# EAGLE design ioniq-v2 (EAGLE 9.6.2)
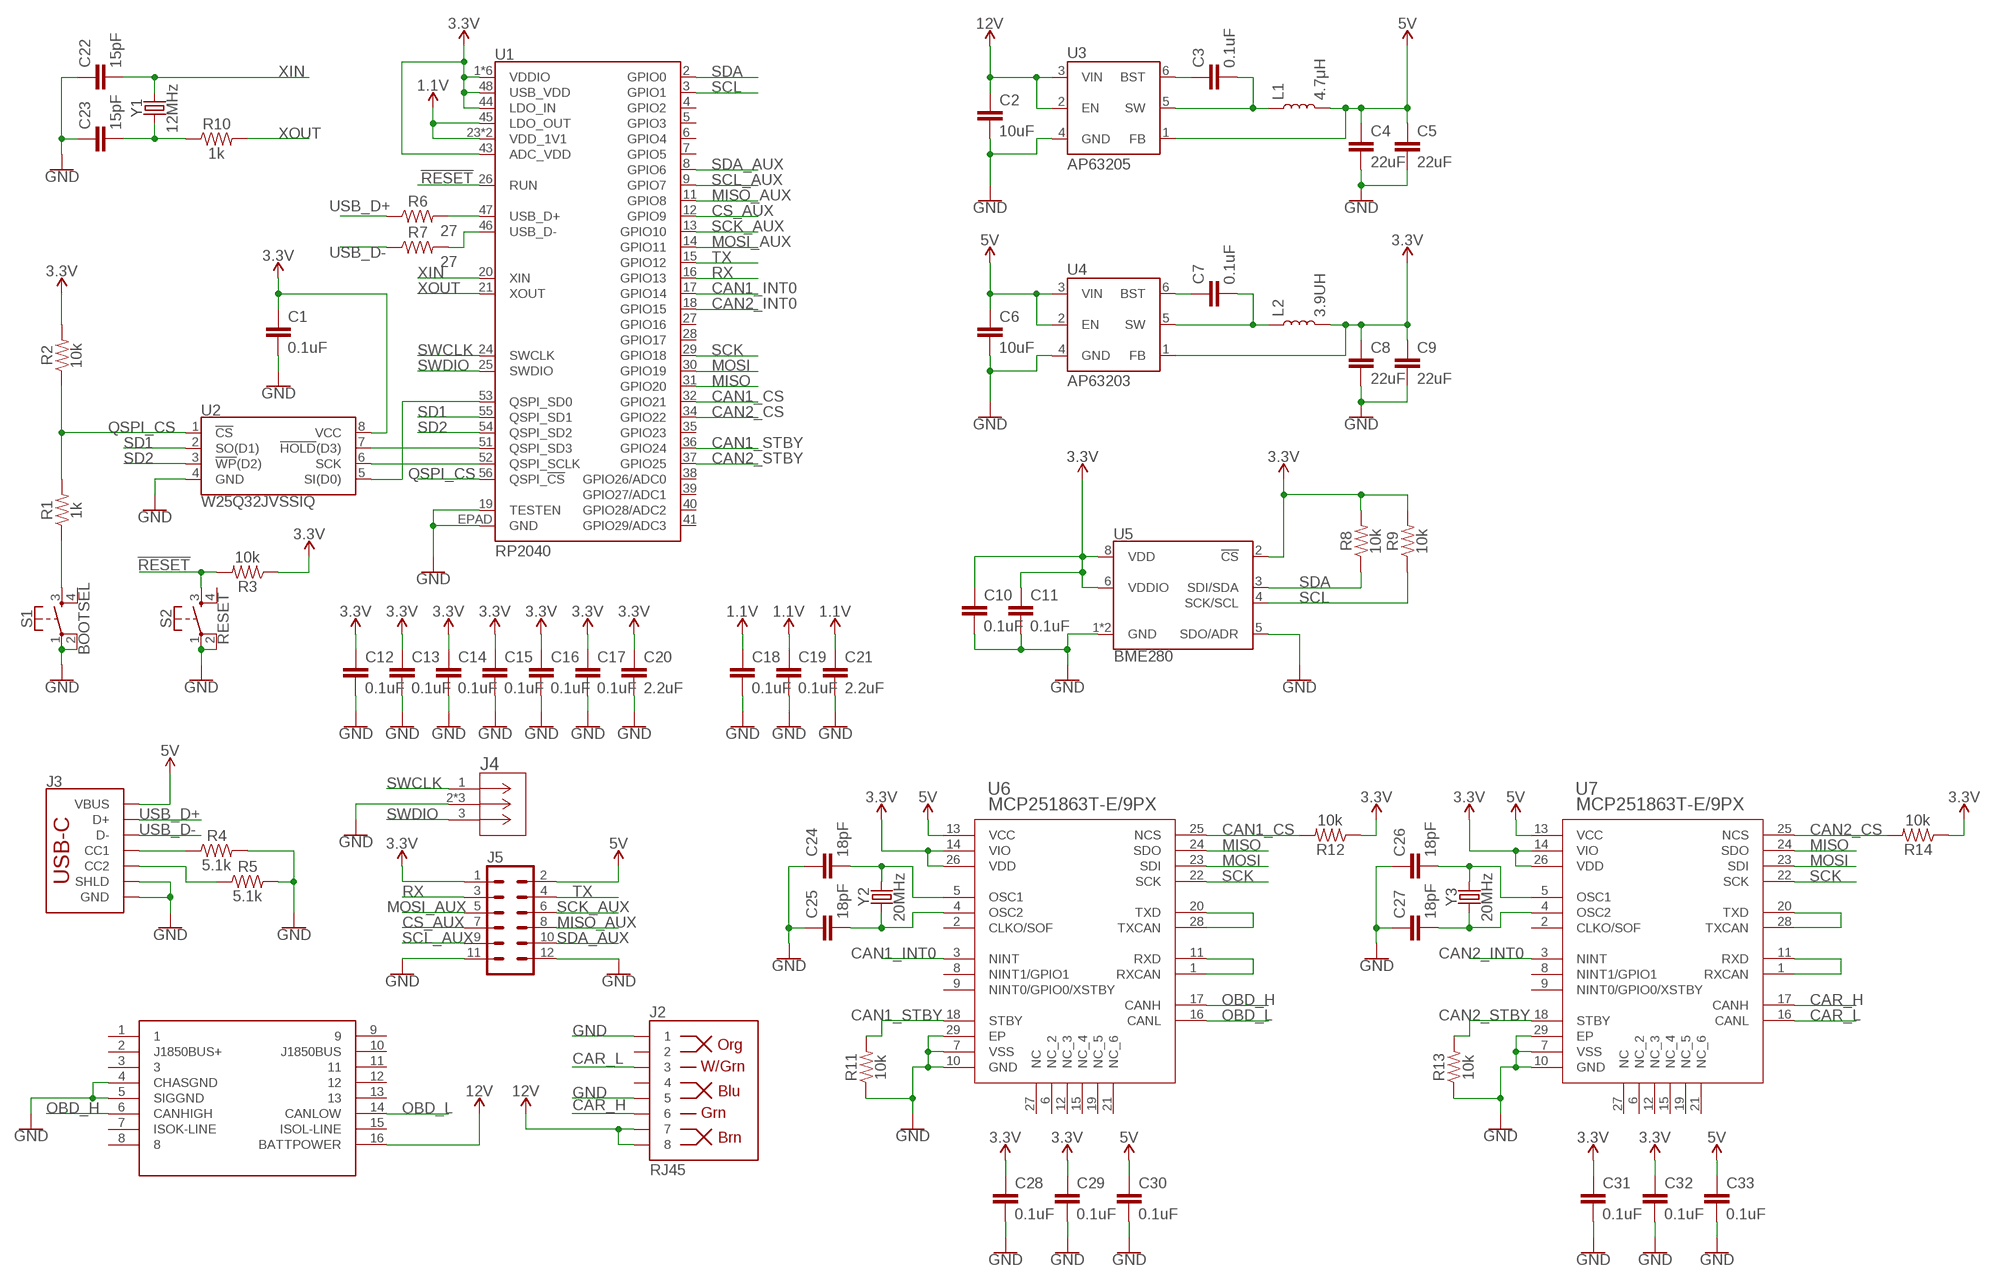
[diagram p0: schematic, sheet 1]

## Parts
C1  0.1uF  0.1UF-0603-25V-10%-X7R-WE  [0603]
C2  10uF  10UF-0805-25V-10%  [0805]
C3  0.1uF  0.1UF-0603-25V-5%  [0603]
C4  22uF  22UF-0603-6.3V-20%  [0603]
C5  22uF  22UF-0603-6.3V-20%  [0603]
C6  10uF  10UF-0805-25V-10%  [0805]
C7  0.1uF  0.1UF-0603-25V-5%  [0603]
C8  22uF  22UF-0603-6.3V-20%  [0603]
C9  22uF  22UF-0603-6.3V-20%  [0603]
C10  0.1uF  0.1UF-0603-25V-10%-X7R-WE  [0603]
C11  0.1uF  0.1UF-0603-25V-10%-X7R-WE  [0603]
C12  0.1uF  0.1UF-0603-25V-10%-X7R-WE  [0603]
C13  0.1uF  0.1UF-0603-25V-10%-X7R-WE  [0603]
C14  0.1uF  0.1UF-0603-25V-10%-X7R-WE  [0603]
C15  0.1uF  0.1UF-0603-25V-10%-X7R-WE  [0603]
C16  0.1uF  0.1UF-0603-25V-10%-X7R-WE  [0603]
C17  0.1uF  0.1UF-0603-25V-10%-X7R-WE  [0603]
C18  0.1uF  0.1UF-0603-25V-10%-X7R-WE  [0603]
C19  0.1uF  0.1UF-0603-25V-10%-X7R-WE  [0603]
C20  2.2uF  2.2UF-0603-10V-20%  [0603]
C21  2.2uF  2.2UF-0603-10V-20%  [0603]
C22  15pF  15PF-0603-50V-5%  [0603]
C23  15pF  15PF-0603-50V-5%  [0603]
C24  18pF  18PF-0603-50V-5%  [0603]
C25  18pF  18PF-0603-50V-5%  [0603]
C26  18pF  18PF-0603-50V-5%  [0603]
C27  18pF  18PF-0603-50V-5%  [0603]
C28  0.1uF  0.1UF-0603-25V-10%-X7R-WE  [0603]
C29  0.1uF  0.1UF-0603-25V-10%-X7R-WE  [0603]
C30  0.1uF  0.1UF-0603-25V-10%-X7R-WE  [0603]
C31  0.1uF  0.1UF-0603-25V-10%-X7R-WE  [0603]
C32  0.1uF  0.1UF-0603-25V-10%-X7R-WE  [0603]
C33  0.1uF  0.1UF-0603-25V-10%-X7R-WE  [0603]
J1  OBDII  [OBDII]
J2  RJ45  RJ45-8  [RJ45-8]
J3  USB_C_2-LAYER_PADS  [USB-C-16P-2LAYER-PADS]
J4  BM03B-SRSS-TB(LF)(SN)  [CONN_BM03B-SRSS-TB(LF)(SN)_JST]
J5  2X6 FEMALE  CONN_06X2PTH_FEMALE  [2X6]
L1  4.7μH  4.7μH_SHIELDED_INDUCTORNPIS_LS  [INDUCTOR_4X4MM]
L2  3.9UH  [INDUCTOR_3.9UH]
R1  1k  1KOHM-0603-1/10W-1%  [0603]
R2  10k  10KOHM-0603-1/10W-1%  [0603]
R3  10k  10KOHM-0603-1/10W-1%  [0603]
R4  5.1k  5.1KOHM5.1KOHM-0603-1/10W-1%  [0603]
R5  5.1k  5.1KOHM5.1KOHM-0603-1/10W-1%  [0603]
R6  27  27OHM-0603-1/10W-1%  [0603]
R7  27  27OHM-0603-1/10W-1%  [0603]
R8  10k  10KOHM-0603-1/10W-1%  [0603]
R9  10k  10KOHM-0603-1/10W-1%  [0603]
R10  1k  1KOHM-0603-1/10W-1%  [0603]
R11  10k  10KOHM-0603-1/10W-1%  [0603]
R12  10k  10KOHM-0603-1/10W-1%  [0603]
R13  10k  10KOHM-0603-1/10W-1%  [0603]
R14  10k  10KOHM-0603-1/10W-1%  [0603]
S1  BOOTSEL  MOMENTARY-SWITCH-SPST-2-SMD-4.6X2.8MM  [TACTILE_SWITCH_SMD_4.6X2.8MM]
S2  RESET  MOMENTARY-SWITCH-SPST-2-SMD-4.6X2.8MM  [TACTILE_SWITCH_SMD_4.6X2.8MM]
U1  RP2040  [QFN-56]
U2  W25Q32JVSSIQ  W25Q32FVSS  [SOIC-8]
U3  AP63205  AP63203  [SOT23-6]
U4  AP63203  [SOT23-6]
U5  BME280  [LGA-8-2.5X2.5]
U6  MCP251863T-E/9PX  [VQFN28_9PX_3P25X3P25EPAD_MCH]
U7  MCP251863T-E/9PX  [VQFN28_9PX_3P25X3P25EPAD_MCH]
Y1  12MHz  CRYSTALSMD-3.2X2.5  [CRYSTAL-SMD-3.2X2.5MM]
Y2  20MHz  CRYSTALSMD-3.2X2.5  [CRYSTAL-SMD-3.2X2.5MM]
Y3  20MHz  CRYSTALSMD-3.2X2.5  [CRYSTAL-SMD-3.2X2.5MM]

## Nets
1.1V: C18.1 C19.1 C21.1 U1.23(VDD_1V1) U1.45(LDO_OUT) U1.50(VDD_1V1)
3.3V: C1.1 C8.1 C9.1 C10.1 C11.1 C12.1 C13.1 C14.1 C15.1 C16.1 C17.1 C20.1 C28.1 C29.1 C31.1 C32.1 J5.1 L2.P$2 R2.2 R3.1 R8.2 R9.2 R12.1 R14.1 U1.1(VDDIO) U1.10(VDDIO) U1.22(VDDIO) U1.33(VDDIO) U1.42(VDDIO) U1.43(ADC_VDD) U1.44(LDO_IN) U1.48(USB_VDD) U1.49(VDDIO) U2.8(VCC) U4.1(FB) U5.2(!CS) U5.6(VDDIO) U5.8(VDD) U6.14(VIO) U6.26(VDD) U7.14(VIO) U7.26(VDD)
5V: C4.1 C5.1 C6.1 C30.1 C33.1 J3.VBUS1(VBUS) J3.VBUS2(VBUS) J5.2 L1.P$2 U3.1(FB) U4.2(EN) U4.3(VIN) U6.13(VCC) U7.13(VCC)
12V: C2.1 J1.16(BATTPOWER) J2.7 J2.8 U3.2(EN) U3.3(VIN)
!RESET: R3.2 S2.3 U1.26(RUN)
CAN1_CS: R12.2 U1.32(GPIO21) U6.25(NCS)
CAN1_INT0: U1.17(GPIO14) U6.3(NINT)
CAN1_STBY: R11.2 U1.36(GPIO24) U6.18(STBY)
CAN2_CS: R14.2 U1.34(GPIO22) U7.25(NCS)
CAN2_INT0: U1.18(GPIO15) U7.3(NINT)
CAN2_STBY: R13.2 U1.37(GPIO25) U7.18(STBY)
CAR_H: J2.6 U7.17(CANH)
CAR_L: J2.3 U7.16(CANL)
CS_AUX: J5.7 U1.12(GPIO9)
GND: C1.2 C2.2 C4.2 C5.2 C6.2 C8.2 C9.2 C10.2 C11.2 C12.2 C13.2 C14.2 C15.2 C16.2 C17.2 C18.2 C19.2 C20.2 C21.2 C22.1 C23.1 C24.1 C25.1 C26.1 C27.1 C28.2 C29.2 C30.2 C31.2 C32.2 C33.2 J1.4(CHASGND) J1.5(SIGGND) J2.1 J2.5 J3.GND J3.GND2(GND) J3.SHLD1(SHLD) J3.SHLD2(SHLD) J3.SHLD3(SHLD) J3.SHLD4(SHLD) J4.2 J4.4 J4.5 J5.11 J5.12 R4.2 R5.2 R11.1 R13.1 S1.1 S1.2 S2.1 S2.2 U1.19(TESTEN) U1.EPAD(GND) U2.4(GND) U3.4(GND) U4.4(GND) U5.1(GND) U5.5(SDO/ADR) U5.7(GND) U6.7(VSS) U6.10(GND) U6.29(EP) U7.7(VSS) U7.10(GND) U7.29(EP)
MISO: U1.31(GPIO20) U6.24(SDO) U7.24(SDO)
MISO_AUX: J5.8 U1.11(GPIO8)
MOSI: U1.30(GPIO19) U6.23(SDI) U7.23(SDI)
MOSI_AUX: J5.5 U1.14(GPIO11)
N$1: U1.52(QSPI_SCLK) U2.6(SCK)
N$2: U1.51(QSPI_SD3) U2.7(!HOLD!(D3))
N$3: U1.53(QSPI_SD0) U2.5(SI(D0))
N$4: J3.A5(CC1) R4.1
N$5: C3.1 U3.6(BST)
N$7: C3.2 L1.P$1 U3.5(SW)
N$8: J3.B5(CC2) R5.1
N$9: C7.1 U4.6(BST)
N$10: C7.2 L2.P$1 U4.5(SW)
N$12: R7.2 U1.46(USB_D-)
N$13: R6.2 U1.47(USB_D+)
N$14: C23.2 R10.1 Y1.1
N$15: R1.1 S1.3
N$16: U6.20(TXD) U6.28(TXCAN)
N$17: U6.1(RXCAN) U6.11(RXD)
N$18: C24.2 U6.5(OSC1) Y2.3
N$19: C25.2 U6.4(OSC2) Y2.1
N$20: U7.1(RXCAN) U7.11(RXD)
N$21: U7.20(TXD) U7.28(TXCAN)
N$22: C26.2 U7.5(OSC1) Y3.3
N$23: C27.2 U7.4(OSC2) Y3.1
OBD_H: J1.6(CANHIGH) U6.17(CANH)
OBD_L: J1.14(CANLOW) U6.16(CANL)
QSPI_CS: R1.2 R2.1 U1.56(QSPI_!CS!) U2.1(!CS!)
RX: J5.3 U1.16(GPIO13)
SCK: U1.29(GPIO18) U6.22(SCK) U7.22(SCK)
SCK_AUX: J5.6 U1.13(GPIO10)
SCL: R9.1 U1.3(GPIO1) U5.4(SCK/SCL)
SCL_AUX: J5.9 U1.9(GPIO7)
SD1: U1.55(QSPI_SD1) U2.2(SO(D1))
SD2: U1.54(QSPI_SD2) U2.3(!WP!(D2))
SDA: R8.1 U1.2(GPIO0) U5.3(SDI/SDA)
SDA_AUX: J5.10 U1.8(GPIO6)
SWCLK: J4.1 U1.24(SWCLK)
SWDIO: J4.3 U1.25(SWDIO)
TX: J5.4 U1.15(GPIO12)
USB_D+: J3.A6(D+) J3.B6(D+) R6.1
USB_D-: J3.A7(D-) J3.B7(D-) R7.1
XIN: C22.2 U1.20(XIN) Y1.3
XOUT: R10.2 U1.21(XOUT)
Unconnected: J1.1 J1.2(J1850BUS+) J1.3 J1.7(ISOK-LINE) J1.8 J1.9 J1.10(J1850BUS) J1.11 J1.12 J1.13 J1.15(ISOL-LINE) J2.2 J2.4 S1.4 S2.4 U1.4(GPIO2) U1.5(GPIO3) U1.6(GPIO4) U1.7(GPIO5) U1.27(GPIO16) U1.28(GPIO17) U1.35(GPIO23) U1.38(GPIO26/ADC0) U1.39(GPIO27/ADC1) U1.40(GPIO28/ADC2) U1.41(GPIO29/ADC3) U6.2(CLKO/SOF) U6.6(NC_2) U6.8(NINT1/GPIO1) U6.9(NINT0/GPIO0/XSTBY) U6.12(NC_3) U6.15(NC_4) U6.19(NC_5) U6.21(NC_6) U6.27(NC) U7.2(CLKO/SOF) U7.6(NC_2) U7.8(NINT1/GPIO1) U7.9(NINT0/GPIO0/XSTBY) U7.12(NC_3) U7.15(NC_4) U7.19(NC_5) U7.21(NC_6) U7.27(NC)

## Library data of the parts
C1 C10-C19 C28-C33 = SparkFun-Capacitors:0.1UF: 0.1µF ceramic capacitors A capacitor is a passive two-terminal electrical component used to store electrical energy temporarily in an electric field.; PROD_ID: CAP-16503
C2 C6 = SparkFun-Capacitors:10UF: 10.0µF ceramic capacitors A capacitor is a passive two-terminal electrical component used to store electrical energy temporarily in an electric field.; PROD_ID: CAP-14259
C3 C7 = SparkFun-Capacitors:0.1UF: 0.1µF ceramic capacitors A capacitor is a passive two-terminal electrical component used to store electrical energy temporarily in an electric field.; PROD_ID: CAP-08604
C4 C5 C8 C9 = SparkFun-Capacitors:22UF: 22µF ceramic capacitors A capacitor is a passive two-terminal electrical component used to store electrical energy temporarily in an electric field.; PROD_ID: CAP-14464
C20 C21 = SparkFun-Capacitors:2.2UF: 2.2µF ceramic capacitors A capacitor is a passive two-terminal electrical component used to store electrical energy temporarily in an electric field.; PROD_ID: CAP-07888
C22 C23 = SparkFun-Capacitors:15PF: 15pF ceramic capacitors A capacitor is a passive two-terminal electrical component used to store electrical energy temporarily in an electric field.; PROD_ID: CAP-07881
C24-C27 = SparkFun-Capacitors:18PF: 18pF ceramic capacitors A capacitor is a passive two-terminal electrical component used to store electrical energy temporarily in an electric field.; PROD_ID: CAP-08267
J1 = SparkFun-Connectors:OBDII: OBD-II Connector OBDII is an on board diagnostics standard that is used on a large variety of cars. Here is the connector we sell at SparkFun: OBD-II connector <https://www.sparkfun.com/products/9911> (DEV-09911) Info and Pinout <http://pinoutsguide.com/CarElectronics/car_obd2_pinout.shtml> (sorry, no datasheet) We do not use this connector on any active designs, however, if you're looking for OBDII tech, please check out these: SparkFun OBD related products <https://www.sparkfun.com/search/results?term=obd>; SF_ID: DEV-09911
J2 = SparkFun-Connectors:RJ45-8: RJ45 Jack - 8 pin Simple RJ45, 8-pin connection. Commonly used for Cat5, Cat5e, and Cat6 Ethernet cables. Here is the connector we sell at SparkFun: RJ45 8-Pin Connector <https://www.sparkfun.com/products/643> (PRT-00643) Datasheet <https://cdn.sparkfun.com/datasheets/Prototyping/04908.pdf> It is used on this SparkFun product: SparkFun RJ45 Breakout <https://www.sparkfun.com/products/716> (BOB-00716) Note, you may also be interested in the "MAGJACK" version of this. It is basically a RJ45 connector, but also has some status LEDs built into the connector housing. You can check that out in this library at the device named "MAGJACK.dev" and see these products online: RJ45 Ethernet MagJack-Compatible <https://www.sparkfun.com/products/8534> (PRT-08534) SparkFun RJ45 MagJack Breakout <https://www.sparkfun.com/products/13021> (BOB-13021); PROD_ID: CONN-08506; SF_ID: PRT-00643
J3 = SparkFun-Connectors:USB_C: USB Type C 16Pin Connector Super Speed pins not available on the 16-pin purely SMD connector so this part is best for USB 2.0 implementations. D1 and D2 are tied together enabling D+/- no matter which way the cable is plugged into the connector. The two channel configuration pins (CC1/2) are exposed. These are normally connected to ground via 5.1k resistors but can be reconfigured for high current/high power applications. **4-LAYER BOARD WARNING!!** If designing 4-layer board, make sure to select the variant _4-LAYER-ISOLATED. The linked footprint (USB-C-16-4LAYER-ISOLATED) includes some very necessary cutout polygons in the inner layers (2 and 15). This prevents the PTH mounting shield legs on the USB connector from electrically connecting any other polygons on the inner layers (usually VCC and GND).; PROD_ID: CONN-14122
J4 = SparkFun-Connectors:BM03B-SRSS-TB(LF)(SN); COPYRIGHT: Copyright (C) 2024 Ultra Librarian. All rights reserved.; MANUFACTURER_PART_NUMBER: BM03B-SRSS-TB(LF)(SN); MFR_NAME: JST
J5 = SparkFun-Connectors:CONN_06X2: Multi connection point. Often used as Generic Header-pin footprint for 0.1 inch spaced/style header connections On any of the 0.1 inch spaced packages, you can populate with these: Break Away Headers - Straight <https://www.sparkfun.com/products/116> (PRT-00116) Break Away Male Headers - Right Angle <https://www.sparkfun.com/products/553> (PRT-00553) Female Headers <https://www.sparkfun.com/products/115> (PRT-00115) Break Away Headers - Machine Pin <https://www.sparkfun.com/products/117> (PRT-00117) Break Away Female Headers - Swiss Machine Pin <https://www.sparkfun.com/products/743> (PRT-00743); PROD_ID: CONN-12423
L1 = SparkFun-Coils:4.7μH_SHIELDED_INDUCTOR: 4.7uH Inductor 4.7uH 1.4A 50mOhm 1008(2520) Package Shielded; PROD_ID: NDUC-15245
L2 = SparkFun-Coils:3.9UH: Würth's Electronik 3.9uH Inductor Characteristics 3.9uH 2.4A Current Rating 2.8A Saturation Inductance Frequency: 100kHzd AEC-Q200 Certified 5mm x 5mm Package 30% tolerance; PROD_ID: NDUC-18014
R1 R10 = SparkFun-Resistors:1KOHM: 1kΩ resistor A resistor is a passive two-terminal electrical component that implements electrical resistance as a circuit element. Resistors act to reduce current flow, and, at the same time, act to lower voltage levels within circuits. - Wikipedia; PROD_ID: RES-07856
R2 R3 R8 R9 R11-R14 = SparkFun-Resistors:10KOHM: 10kΩ resistor A resistor is a passive two-terminal electrical component that implements electrical resistance as a circuit element. Resistors act to reduce current flow, and, at the same time, act to lower voltage levels within circuits. - Wikipedia; PROD_ID: RES-00824
R4 R5 = SparkFun-Resistors:5.1KOHM; PROD_ID: RES-12083
R6 R7 = SparkFun-Resistors:27OHM: 27Ω resistor A resistor is a passive two-terminal electrical component that implements electrical resistance as a circuit element. Resistors act to reduce current flow, and, at the same time, act to lower voltage levels within circuits. - Wikipedia; PROD_ID: RES-09334
S1 S2 = SparkFun-Switches:MOMENTARY-SWITCH-SPST-2: Momentary Switch (Pushbutton) - SPST - Two Circuits Normally-open (NO) SPST momentary switches (buttons, pushbuttons). Schematic symbol includes two switch circuits. Variants SMD-4.6MMX2.8MM - 4.60mm x 2.80mm Tactile Momentary Button Switch - Used on SparkFun Pro Micro - RP2040 <https://www.sparkfun.com/products/17717> SMD-5.2MM - Mini Pushbutton Switch - SMD <https://www.sparkfun.com/products/8720> - Used on Arduino Pro Mini <https://www.sparkfun.com/products/11114>; PROD_ID: SWCH-15606
U1 = SparkFun-IC-Microcontroller:RP2040: Raspberry Pi RP2040 MCU 56-pin 32-bit Microcontroller with 264kB of SRAM and external flash support up to 16MB Getting Started with the RP2040 <https://pico.raspberrypi.org/getting-started/> Dual-core ARM Cortex M0+ processor, flexible clock running up to 133 MHz 264kB of SRAM, and QSPI control of common flash memory USB 1.1 Host and Device support Low-power sleep and dormant modes Drag & drop programming using mass storage over USB 26 multi-function GPIO pins 2×SPI, 2×I2C, 2×UART, 3×12-bit ADC, 16×controllable PWM channels Accurate clock and timer on-chip Temperature sensor Accelerated floating point libraries on-chip 8×Programmable IO (PIO) state machines for custom peripheral support; PROD_ID: IC-15502
U2 = SparkFun-IC-Memory:W25Q32FV: W25Q32FV 32Mb (4MB) Serial Flash Memory The W25Q32FV support the standard Serial Peripheral Interface (SPI), Dual/Quad I/O SPI as well as 2-clocks instruction cycle Quad Peripheral Interface (QPI). 104MHz, SPI, 8-SOIC-EIAJ Datasheet <http://www.winbond.com/resource-files/w25q32fv%20revh%20091613.pdf> SparkFun Products SparkFun Blynk Board - ESP8266 <https://www.sparkfun.com/products/13794> (WRL-13794); PROD_ID: IC-13229; VALUE: W25Q32FV
U3 = SparkFun-IC-Power:AP63203: Diodes Inc. AP63203 3.8V-32V input 3.3V Buck The AP63200/AP63201/AP63203/AP63205 is a 2A, synchronous buck converter with a wide input voltage range of 3.8V to 32V and fully integrates a 125mΩ high-side power MOSFET and a 68mΩ lowside power MOSFET to provide high-efficiency step-down DC/DC conversion; PROD_ID: VREG-15244; VALUE: AP63203
U4 = SparkFun-IC-Power:AP63203: Diodes Inc. AP63203 3.8V-32V input 3.3V Buck The AP63200/AP63201/AP63203/AP63205 is a 2A, synchronous buck converter with a wide input voltage range of 3.8V to 32V and fully integrates a 125mΩ high-side power MOSFET and a 68mΩ lowside power MOSFET to provide high-efficiency step-down DC/DC conversion; PROD_ID: VREG-15244
U5 = SparkFun-Sensors:BME280: Bosch BME280 – Combined Humidity and Pressure Sensor The BME280 is as combined digital humidity, pressure and temperature sensor based on proven sensing principles. The sensor module is housed in an extremely compact metal-lid LGA package with a footprint of only 2.5×2.5mm² with a height of 0.93mm. Its small dimensions and its low power consumption allow the implementation in battery driven devices such as handsets, GPS modules or watches. Datasheet <https://cdn.sparkfun.com/assets/learn_tutorials/4/1/9/BST-BME280_DS001-10.pdf> SparkFun Products SparkFun Atmospheric Sensor Breakout - BME280 <https://www.sparkfun.com/products/13676> (SEN-13676); PROD_ID: IC-13090
U6 U7 = SparkFun-IC-Comms:MCP251863T-E/9PX; COPYRIGHT: Copyright (C) 2024 Ultra Librarian. All rights reserved.; MANUFACTURER_PART_NUMBER: MCP251863T-E/9PX; MFR_NAME: Microchip; TYPE: Interface
Y1-Y3 = SparkFun-Clocks:CRYSTAL: Crystals (Generic) These are passive quartz crystals, which can be used as a clock source for a microcontroller. Crystal's are two-terminal devices. They require external "load" capacitors to generate an oscillating signal.

## Board
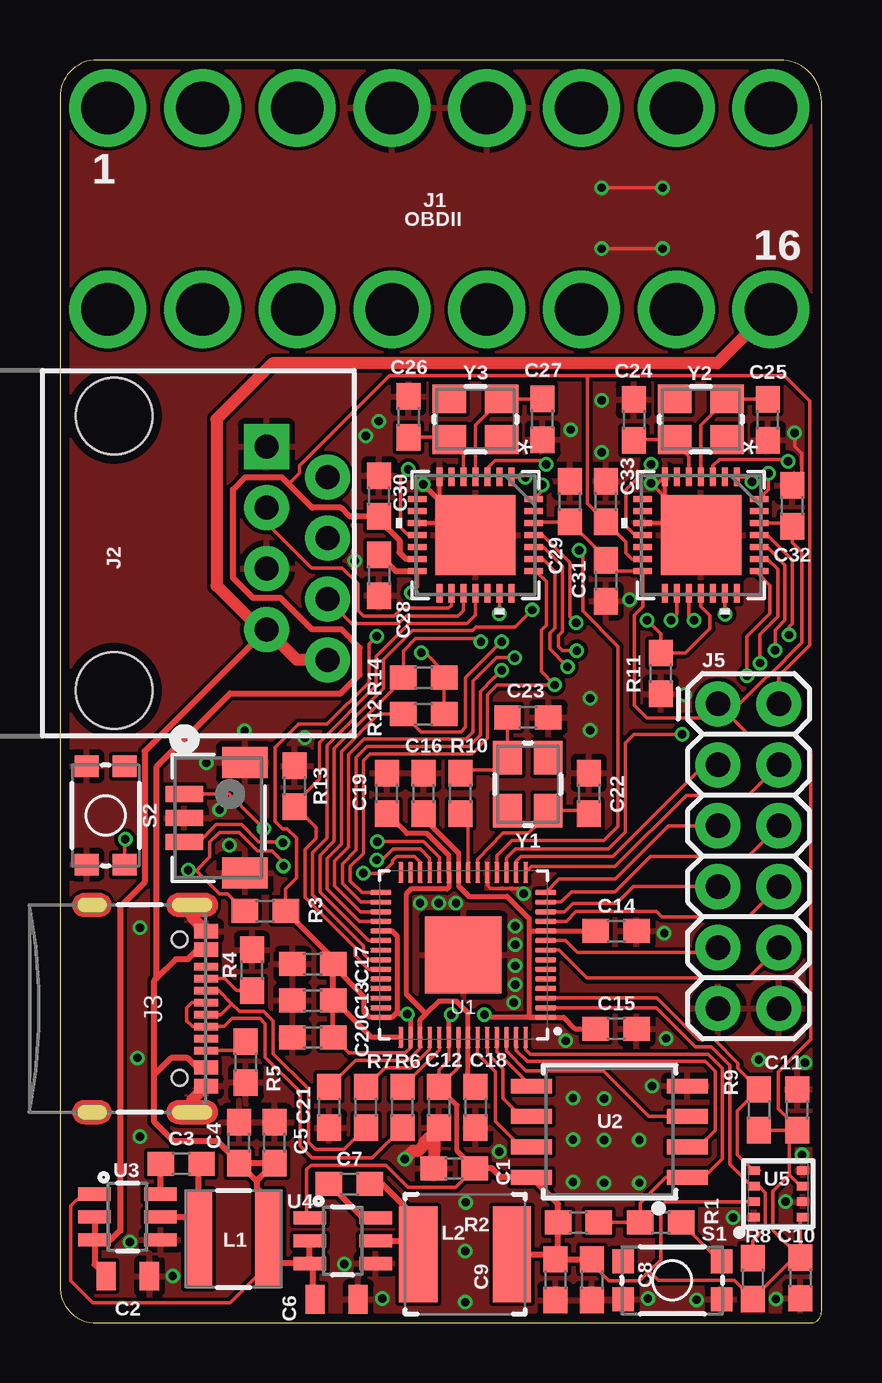
[diagram p1: board, top side]
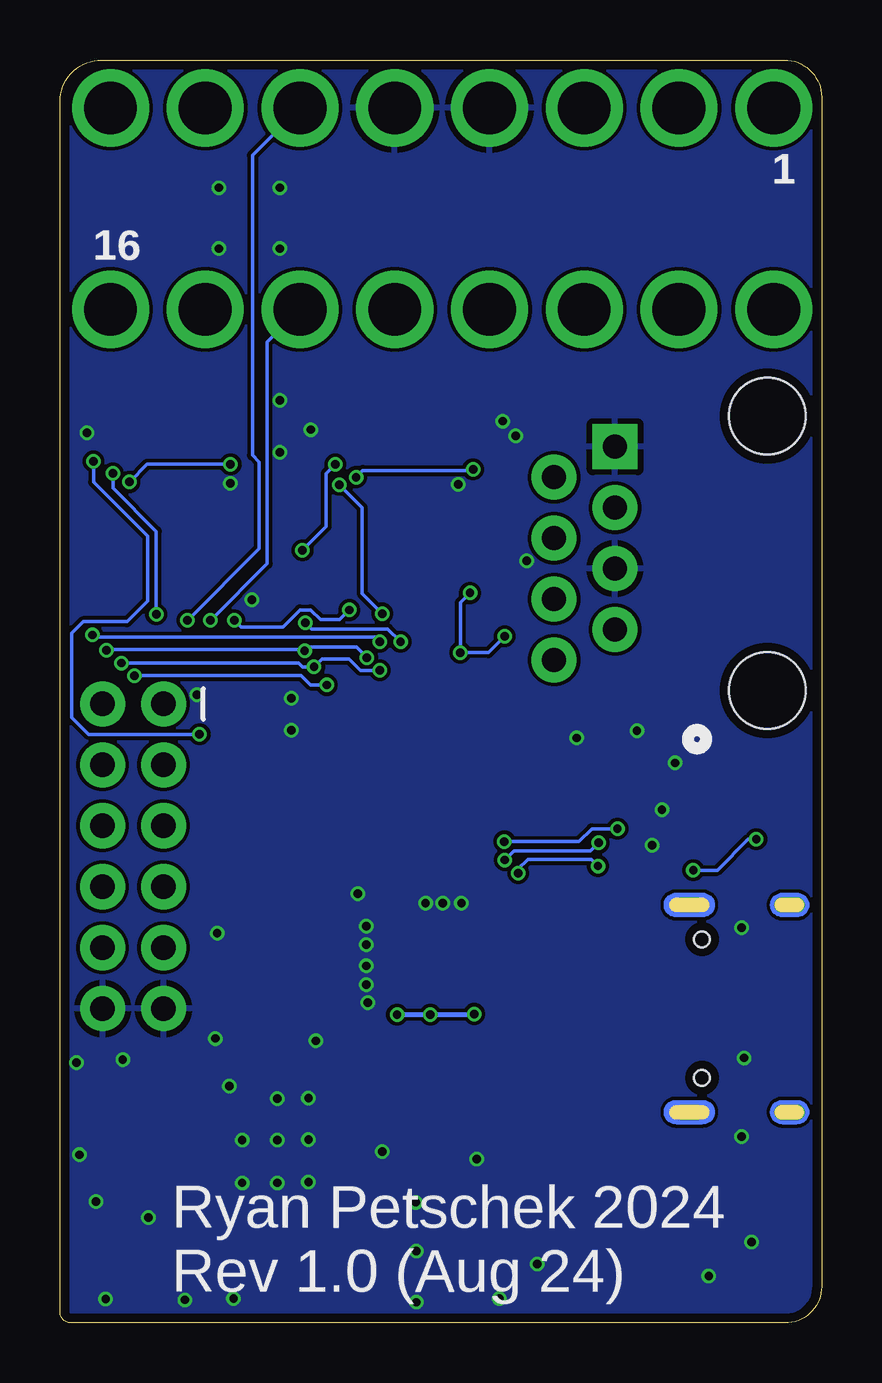
[diagram p2: board, bottom side, seen from below]

Size 31.75 x 52.64 mm. Coordinates in mm from the lower left corner, seen from the top.
Outline: 0,51.1 0,1.52 arc90 1.52,0 31.28,0 arc90 31.75,0.47 31.75,50.9 arc90 30.01,52.64 1.54,52.64 arc90 0,51.1
Copper layers (1*16): Top 0.035559375mm / dielectric 1.6mm / Bottom 0.035559375mm
Design rules "oshpark-2layer": minimum track width 6mil, minimum drill 10mil, track to track 6mil, track to pad 6mil, pad to pad 6mil, via to via 6mil, smd to smd 6mil, copper to edge 15mil, drill to drill 6mil, minimum pad ring 5mil, minimum via ring 5mil, stop-mask expansion 2.5mil, vias tented up to drill 0mil, thermal gap 10mil

### Footprints (pad centres in the part's own frame; a part is rotated, then mirrored left to right if it is on the bottom)
0603 = smd 1.1 x 1: 1 -0.85,0; 2 0.85,0
0805 = smd 0.8 x 1.2: 1 -0.9,0; 2 0.9,0
OBDII = drill 2.2: 1 13.68,-3.81; 2 9.73,-3.81; 3 5.78,-3.81; 4 1.83,-3.81; 5 -2.12,-3.81; 6 -6.07,-3.81; 7 -10.02,-3.81; 8 -13.97,-3.81; 9 13.68,4.59; 10 9.73,4.59; 11 5.78,4.59; 12 1.83,4.59; 13 -2.12,4.59; 14 -6.07,4.59; 15 -10.02,4.59; 16 -13.97,4.59
RJ45-8 = drill 1 pad 1.88 square: 1 -4.445,6.35 | drill 1 pad 1.88: 2 -3.175,8.89; 3 -1.905,6.35; 4 -0.635,8.89; 5 0.635,6.35; 6 1.905,8.89; 7 3.175,6.35; 8 4.445,8.89 | hole 3.2: -5.715,0; 5.715,0
USB-C-16P-2LAYER-PADS = smd 0.3 x 1: A5 -1.25,-0.34; A6 -0.25,-0.34; A7 0.25,-0.34; A8 1.25,-0.34; B5 1.75,-0.34; B6 0.75,-0.34; B7 -0.75,-0.34; B8 -1.75,-0.34 | smd 0.6 x 1: GND -3.225,-0.34; GND2 3.225,-0.34; VBUS1 -2.45,-0.34; VBUS2 2.45,-0.34 | drill 0.4 pad 0.6 long: SHLD1 -4.318,-0.915; SHLD2 4.318,-0.915; SHLD3 -4.318,-5.095; SHLD4 4.318,-5.095 | hole 0.65: -2.89,-1.445; 2.89,-1.445
CONN_BM03B-SRSS-TB(LF)(SN)_JST = smd 0.66 x 1.549: 1 1,1.428; 2 0,1.428; 3 -1,1.428 | smd 1.295 x 1.905: 4 -2.3,-1.097; 5 2.3,-1.097
2X6 = drill 1.016 pad 1.88: 1 0,0; 2 0,2.54; 3 2.54,0; 4 2.54,2.54; 5 5.08,0; 6 5.08,2.54; 7 7.62,0; 8 7.62,2.54; 9 10.16,0; 10 10.16,2.54; 11 12.7,0; 12 12.7,2.54
INDUCTOR_4X4MM = smd 4.089 x 1.143: P$1 0,1.473; P$2 0,-1.473
INDUCTOR_3.9UH = smd 4 x 1.6: P$1 0,-2; P$2 0,1.9
TACTILE_SWITCH_SMD_4.6X2.8MM = smd 0.9 x 1: 1 -2.05,-0.8; 2 2.05,-0.8; 3 2.05,0.8; 4 -2.05,0.8
QFN-56 = smd 0.875 x 0.2: 1 -3.437,2.6; 2 -3.437,2.2; 3 -3.437,1.8; 4 -3.437,1.4; 5 -3.437,1; 6 -3.437,0.6; 7 -3.437,0.2; 8 -3.437,-0.2; 9 -3.437,-0.6; 10 -3.437,-1; 11 -3.437,-1.4; 12 -3.437,-1.8; 13 -3.437,-2.2; 14 -3.437,-2.6; 29 3.437,-2.6; 30 3.437,-2.2; 31 3.437,-1.8; 32 3.437,-1.4; 33 3.437,-1; 34 3.437,-0.6; 35 3.437,-0.2; 36 3.437,0.2; 37 3.437,0.6; 38 3.437,1; 39 3.437,1.4; 40 3.437,1.8; 41 3.437,2.2; 42 3.437,2.6 | smd 0.2 x 0.875: 15 -2.6,-3.437; 16 -2.2,-3.437; 17 -1.8,-3.437; 18 -1.4,-3.437; 19 -1,-3.437; 20 -0.6,-3.437; 21 -0.2,-3.437; 22 0.2,-3.437; 23 0.6,-3.437; 24 1,-3.437; 25 1.4,-3.437; 26 1.8,-3.437; 27 2.2,-3.437; 28 2.6,-3.437; 43 2.6,3.437; 44 2.2,3.437; 45 1.8,3.437; 46 1.4,3.437; 47 1,3.437; 48 0.6,3.437; 49 0.2,3.437; 50 -0.2,3.437; 51 -0.6,3.437; 52 -1,3.437; 53 -1.4,3.437; 54 -1.8,3.437; 55 -2.2,3.437; 56 -2.6,3.437 | smd 3.2 x 3.2: EPAD 0,0
SOIC-8 = smd 0.61 x 1.702: 1 -1.905,-3.251; 2 -0.635,-3.251; 3 0.635,-3.251; 4 1.905,-3.251; 5 1.905,3.251; 6 0.635,3.251; 7 -0.635,3.251; 8 -1.905,3.251
SOT23-6 = smd 0.55 x 1.35: 1 -0.95,-1.375; 2 0,-1.375; 3 0.95,-1.375; 4 0.95,1.375; 5 0,1.375; 6 -0.95,1.375
LGA-8-2.5X2.5 = smd 0.35 x 0.5: 1 -0.975,1.025; 2 -0.325,1.025; 3 0.325,1.025; 4 0.975,1.025; 5 0.975,-1.025; 6 0.325,-1.025; 7 -0.325,-1.025; 8 -0.975,-1.025
VQFN28_9PX_3P25X3P25EPAD_MCH = smd 0.762 x 0.254: 1 -2.426,1.5; 2 -2.426,1; 3 -2.426,0.5; 4 -2.426,0; 5 -2.426,-0.5; 6 -2.426,-1; 7 -2.426,-1.5; 15 2.426,-1.5; 16 2.426,-1; 17 2.426,-0.5; 18 2.426,0; 19 2.426,0.5; 20 2.426,1; 21 2.426,1.5 | smd 0.254 x 0.762: 8 -1.5,-2.426; 9 -1,-2.426; 10 -0.5,-2.426; 11 0,-2.426; 12 0.5,-2.426; 13 1,-2.426; 14 1.5,-2.426; 22 1.5,2.426; 23 1,2.426; 24 0.5,2.426; 25 0,2.426; 26 -0.5,2.426; 27 -1,2.426; 28 -1.5,2.426 | smd 3.353 x 3.353: 29 0,0
CRYSTAL-SMD-3.2X2.5MM = smd 1.4 x 1.2: 1 -1.1,-0.85; 2 1.1,-0.85; 3 1.1,0.85; 4 -1.1,0.85

### Placement (x,y rotation side)
C1  16.43,6.45 180 top
C2  2.83,1.96 0 top
C3  5.05,6.63 0 top
C4  7.47,7.52 90 top
C5  8.94,7.52 90 top
C6  11.53,0.99 0 top
C7  12.06,5.79 0 top
C8  22.17,1.8 270 top
C9  20.65,1.8 270 top
C10  30.86,1.88 270 top
C11  30.73,8.89 90 top
C12  15.8,8.99 270 top
C13  10.54,13.44 180 top
C14  23.19,16.33 0 top
C15  23.19,12.27 0 top
C16  15.16,22.07 90 top
C17  10.54,14.96 180 top
C18  17.32,8.99 270 top
C19  13.64,22.07 90 top
C20  10.54,11.91 180 top
C21  11.23,8.99 270 top
C22  22.05,22.07 270 top
C23  19.51,25.25 180 top
C24  23.93,37.64 270 top
C25  29.51,37.64 90 top
C26  14.53,37.77 270 top
C27  20.12,37.67 90 top
C28  13.31,31.17 270 top
C29  21.26,34.24 90 top
C30  13.31,34.47 90 top
C31  22.76,30.94 270 top
C32  30.53,34.06 90 top
C33  22.76,34.24 90 top
J1  15.67,46.84 180 top
J2  2.26,32.08 270 top
J3  6.43,13.11 270 top
J4  6.61,21.06 90 top
J5  27.43,25.81 270 top
L1  7.24,3.51 90 top
L2  16.94,2.87 270 top
R1  25.04,4.19 180 top
R2  21.62,4.19 180 top
R3  8.56,17.17 180 top
R4  8,14.71 90 top
R5  7.75,10.87 270 top
R6  14.27,8.99 90 top
R7  12.75,8.99 90 top
R8  28.88,1.85 270 top
R9  29.13,8.89 270 top
R10  16.69,22.07 270 top
R11  25.04,27.08 90 top
R12  15.16,25.37 180 top
R13  9.78,22.38 270 top
R14  15.16,26.9 180 top
S1  25.53,1.78 0 top
S2  1.91,21.16 270 top
U1  16.81,15.34 180 top
U2  22.91,7.98 90 top
U3  2.82,4.42 270 top
U4  11.79,3.43 270 top
U5  29.95,5.38 90 top
U6  26.72,32.84 270 top
U7  17.32,32.84 270 top
Y1  19.51,22.45 270 top
Y2  26.72,37.67 180 top
Y3  17.32,37.67 180 top

### Tracks (layer width: path | path; a pad name or v marks a point on that pad's centre or on a via)
1.1V
  Top 0.152: C18.1 17.01,10.15 | U1.45 15.01,11.44 14.52,10.95 12.33,10.95 C21.1
  Top 0.203: 15.27,12.88 15.8,13.41 16.54,13.41 17.01,12.93 U1.50 17.01,10.15 | U1.45 15.01,12.63 15.27,12.88 | 15.27,12.88 14.43,13.72 14.43,17.88 14.63,18.09 16.13,18.09 16.21,18.17 U1.23 16.21,19.49 15.31,20.4 14.47,20.4 C19.1
3.3V  (via drill 0.35)
  Top 0.152: U1.49 16.61,10.66 C12.1 15.81,9.85 15.81,10.56 16.21,10.96 U1.48 | 11.39,14.9 C17.1 | 14.61,11.48 14.39,11.25 12.05,11.25 C20.1 | C1.1 16.5,5.66 14.5,5.66 13.59,6.58 10.46,6.58 10.28,6.4 10.28,4.51 U4.1 | C8.1 22.17,2.46 22.89,1.75 24.15,1.75 24.56,2.16 | 30.94,4.41 U5.8 30.86,4.3 C10.1 | 30.4,6.18 30.87,5.71 U5.6 | C11.1 30.73,7.94 30.4,7.6 30.4,6.18 | 24.56,2.16 25.04,2.64 25.04,4.85 25.25,5.05 U5.2 | 24.56,2.16 24.94,1.78 28.11,1.78 R8.2 30.61,2.73 C10.1 | U6.26 30.4,33.34 C32.1 30.53,32.54 30.93,32.13 30.93,28.36 29.55,26.98 29.49,26.98 28.32,25.81 J5.1 | U7.26 19.8,33.39 C29.1 22.76,31.89 C31.1 23.2,31.34 U6.14 24.3,29.86 23.95,29.52 23.95,25.73 24.46,25.22 26.85,25.22 J5.1 | R12.1 R14.1 16.01,27.14 15.21,27.94 v15.06,27.94 | v14.66,30.43 v14.66,30.44 14.9,30.68 U7.14 | v13.21,28.63 12.88,28.3 12.88,26.7 11.14,24.97 9.96,24.97 8.97,23.98 8.97,20.9 9.27,20.6 9.47,20.6 9.86,20.21 9.86,18.54 9.41,18.1 R3.1 | J5.1 28.7,24.54 30.61,24.54 31.29,23.85 31.29,11.83 29.94,10.47 29.94,8.93 30.73,8.14 C11.1 | R9.2 C11.1 | 30.4,6.18 29.72,5.5 29.72,3.87 C10.1
  Top 0.203: C16.1 15.16,21.05 16.61,19.59 U1.22 16.61,18.21 17.04,17.78 18.64,17.78 19.56,16.87 19.56,16.41 | C1.1 16.56,7.17 16.56,9.08 C12.1 | 19.56,16.41 19.62,16.34 U1.10 C14.1 | U1.1 19.56,12.74 19.56,16.41 | C20.1 C13.1 11.46,13.44 12.99,11.91 U1.43 | 14.07,12.96 13.85,12.74 U1.42 12.9,12.74 12.69,12.96 12.69,13.6 11.39,14.9 | U1.33 13.85,16.34 14.07,16.12 14.07,12.96 | U2.8 | R3.1 11.39,15.19 C17.1 | U1.1 21,12.74 21.48,12.27 C15.1 | U1.48 16.21,12.77 v16.3,12.86 | v17.7,12.85 17.81,12.74 U1.1 | U1.44 14.61,12.74 v14.48,12.88 14.16,12.88 14.07,12.96
  Top 0.254: C13.1 C17.1 | L2.P$2 20.43,2.87 C9.1 | C9.1 C8.1 | C9.1 20.77,2.77 R2.2 20.77,4.97 U2.8 18.39,6.07 18.01,6.45 C1.1 | C28.1 13.98,31.34 U7.14
  Bottom 0.152: v14.66,30.43 15.06,30.02 v15.06,27.94 13.89,27.94 v13.21,28.63
  Bottom 0.203: v17.7,12.85 v17.69,12.86 v16.3,12.86 14.5,12.86 v14.48,12.88
5V
  Top 0.152: U3.1 0.95,5.37 0.46,4.88 0.46,1.75 1.37,0.84 7.1,0.84 8.74,2.48 | U6.13 23.84,31.83 23.58,32.1 23.58,32.55 C33.1 22,34.15 22,39.5 | 9.52,34.98 9.98,35.43 9.98,35.74 13.74,39.5 22,39.5 | 22,39.5 30.2,39.5 31.27,38.43 31.27,28.26 29.97,26.97 J5.2
  Top 0.254: J3.VBUS1 5.72,15.56 5.33,15.16 4.83,15.16 4.04,14.38 | J3.VBUS2 5.72,10.66 5.33,11.05 4.64,11.05 3.94,10.35 | 3.94,10.35 3.94,8.38 4.75,7.57 6.57,7.57 C4.1 | 4.04,14.38 3.94,14.27 3.94,10.35 | C4.1 C5.1 8.2,5.93 | C4.1 8.2,5.93 | 8.2,5.93 8.2,5.66 8.71,5.16 L1.P$2 8.66,3.45 8.66,2.48 8.74,2.48 U4.3 | U4.3 U4.2 | U4.3 10.54,2.35 10.54,1.08 C6.1 | 4.04,14.38 4.04,23.19 7.09,26.24 11.71,26.24 12.5,27.03 12.5,28.14 11.73,28.91 10.52,28.91 9.2,30.23 8.04,30.23 7.21,31.06 7.21,34.75 7.72,35.26 9.25,35.26 9.52,34.98 10.52,33.99 11.71,33.99 12.08,33.62 C30.1 13.31,33.47 14.15,32.63 14.15,32.12 14.42,31.84 U7.13
12V
  Top 0.254: U3.3 1.44,2.44 C2.1 | U3.3 2.12,3.47 2.51,3.86 2.51,17.35 3.53,18.36 3.53,23.83 J2.7 | U3.2 U3.3
  Top 0.508: J1.16 27.4,40.01 8.86,40.01 6.53,37.67 6.53,30.73 8.36,28.91 J2.7 9.88,27.64 J2.8
!RESET  (via drill 0.35)
  Top 0.152: v12.65,18.75 13.44,18.75 13.87,19.18 13.87,19.28 14.03,19.44 14.79,19.44 15.01,19.22 U1.26 | S2.3 2.7,20.15 v2.72,20.17 | R3.2 7,17.88 6.66,17.88 5.67,18.87 v5.34,18.87 5.69,18.87 6.25,19.43 6.25,20.05 6.65,20.45 7.46,20.45 8.23,19.69 8.84,19.69 9.32,19.2 v9.32,19.05
  Bottom 0.152: v12.65,18.75 12.65,18.92 12.24,19.33 9.6,19.33 v9.32,19.05 | v2.72,20.17 3.05,20.17 4.35,18.87 v5.34,18.87
CAN1_CS  (via drill 0.35)
  Top 0.152: U1.32 12.5,16.74 11.14,18.1 11.14,19.37 11.73,19.96 11.73,23.82 13.29,25.37 R12.2 15.05,24.64 16.71,24.64 16.92,24.84 16.92,26.9 v18.41,28.4 | U6.25 29.49,32.84 30.53,31.8 30.53,29.16 30.4,29.03 v30.4,28.68
  Bottom 0.152: v30.4,28.68 30.33,28.6 18.61,28.6 v18.41,28.41 v18.41,28.4
CAN1_INT0  (via drill 0.35)
  Top 0.152: U1.17 18.61,19.38 19,19.76 22.86,19.76 23.57,20.47 23.57,24.18 23.93,24.54 v25.93,24.54 | U6.3 27.22,35.73 27.48,35.99 28.62,35.99 30.28,35.99 v30.35,35.92
  Bottom 0.152: v30.35,35.92 30.35,35.05 28.09,32.79 28.09,30.1 28.96,29.24 30.78,29.24 31.27,28.75 31.27,25.25 30.56,24.54 v25.93,24.54
CAN1_STBY  (via drill 0.35)
  Top 0.152: U1.36 12.9,15.14 12.65,15.39 12.65,15.73 10.53,17.85 10.53,19.62 11.13,20.21 11.13,24.08 13.49,26.44 13.49,27.65 14.69,28.85 17.2,28.85 17.35,29.01 18.97,29.01 v19.68,29.72 | v24.49,29.29 25.04,28.73 R11.2 26.07,27.93 27.1,28.96 27.1,29.49 26.72,29.87 U6.18
  Bottom 0.152: v24.49,29.29 24.21,29.01 22.45,29.01 21.74,29.72 21.31,29.72 21.29,29.72 20.89,29.31 20.09,29.31 v19.68,29.72
CAN2_CS  (via drill 0.35)
  Top 0.152: U1.34 12.86,15.94 10.83,17.97 10.83,19.49 11.43,20.09 11.43,23.95 14.3,26.82 14.3,26.86 14.31,26.87 R14.2 14.31,28.02 14.82,28.52 17.42,28.52 v17.55,28.4 | U7.25 20.12,32.84 21.26,31.7 21.26,29.44 v21.51,29.18
  Bottom 0.152: v21.51,29.18 21.26,28.93 18.09,28.93 v17.55,28.4
CAN2_INT0  (via drill 0.35)
  Top 0.152: U7.3 17.82,35.63 18.14,35.94 20.12,35.94 v20.27,35.79 | U1.18 18.21,19.49 18.83,20.1 22.67,20.1 23.27,20.7 23.27,28.19 21.79,29.67 21.79,32.06 v21.64,32.21
  Bottom 0.152: v20.27,35.79 20.65,35.41 20.65,33.2 v21.64,32.21
CAN2_STBY
  Top 0.152: U1.37 12.87,14.74 12.29,15.32 12.29,15.65 10.21,17.73 10.21,19.73 10.67,20.19 10.67,20.65 R13.2 9.78,21.63 10.82,22.67 10.82,24.2 13.18,26.56 13.18,27.79 14.55,29.16 16.97,29.16 17.32,29.52 U7.18
CAR_H
  Top 0.152: J2.6 12.17,29.16 14.12,29.16 14.44,29.48 16.6,29.48 16.82,29.7 U7.17
CAR_L
  Top 0.152: J2.3 8.61,33.35 10.49,31.47 11.76,31.47 12.42,30.81 12.42,29.69 12.65,29.46 13.93,29.46 14.26,29.79 16.21,29.79 16.32,29.91 U7.16
CS_AUX
  Top 0.152: U1.12 21.03,17.14 21.38,17.49 23.2,17.49 23.9,18.19 J5.7
GND  (via drill 0.35)
  Top 0.152: v22.58,47.32 v25.12,47.32 | v22.58,44.78 v25.12,44.78 | U6.10 26.22,33.34 | 26.22,33.34 U6.29 26.72,32.92 v24.64,35 24.95,35 U6.7 25.22,34.34 26.22,33.34 | U7.10 16.15,33.34 | 16.15,33.34 16.82,33.34 U7.29 | U7.7 15.82,33.67 16.15,33.34 | U1.19 17.81,18.25 17.96,18.11 19.1,18.11 v19.33,17.89 | v30.63,37.11 30.63,36.54 30.93,36.24 30.93,35.32 C32.2
  Top 0.203: v15.14,34.95 15.37,34.72 15.38,34.72 17.26,32.84 U7.29
  Top 0.508: J3.GND 5.51,16.91 J3.SHLD1 | J3.GND2 5.51,9.31 J3.SHLD2 | C1.2 15.58,7.93 C12.2 15.18,7.52 15.18,7.42 14.94,7.19 14.73,7.19 v14.38,6.83
  other vias: 12.75,36.98 13.28,37.59 22.1,26.04 22.1,24.71 26.04,26.19 22.58,38.46 12.29,31.78 21.29,37.24 22.58,36.3 23.75,30.15 15.01,17.5 15.8,17.5 16.51,17.5 18.97,16.54 18.97,15.77 18.97,14.88 18.97,14.1 18.92,13.36 29.13,10.97 31.06,10.85 25.27,11.86 24.69,9.88 18.31,7.14 21.39,9.37 22.68,9.35 21.39,7.65 21.39,5.87 22.68,5.84 22.68,7.62 24.16,7.62 24.16,5.84 30.94,7.01 28.07,4.39 26.54,0.97 24.51,1.02 16.92,5.03 16.89,0.86 16.89,3 13.44,1.02 11.86,2.46 4.7,1.96 2.92,3.38 3.33,7.77 3.33,16.48 3.23,11.05 6.1,23.34 7.7,24.69 6.65,21.39 7.06,19.91 25.2,16.26 21.08,11.76 10.21,24.38 30.25,5.05 29.85,0.99
  pour Bottom: 31.98,52.81 31.98,-0.08 32.05,-0.15 -0.13,-0.15 -0.13,52.81
  pour Top: 31.98,52.81 31.98,-0.08 32.05,-0.15 -0.13,-0.15 -0.13,52.81
MISO  (via drill 0.35)
  Top 0.152: U1.31 12.53,17.14 11.46,18.21 11.46,19.25 12.04,19.83 12.04,23.7 12.68,24.33 16.92,24.33 17.22,24.64 17.22,26.76 18.2,27.73 v18.95,27.73 | U7.24 20.16,32.34 20.95,31.55 20.95,28.83 20.78,28.65 20.78,28.19 20.94,28.03 v21.55,28.03 | U6.24 29.48,32.34 30.23,31.6 30.23,29.29 29.82,28.89 v29.82,28.05
  Bottom 0.152: v29.82,28.05 29.82,28.08 21.6,28.08 v21.55,28.03 21.41,28.17 19.39,28.17 v18.95,27.73
MISO_AUX
  Top 0.152: U1.11 21.11,16.74 21.51,17.15 24.87,17.15 25.1,16.92 28.7,16.92 J5.8
MOSI  (via drill 0.35)
  Top 0.152: U1.30 12.56,17.54 11.77,18.33 11.77,19.14 12.34,19.71 12.34,23.57 12.8,24.03 17.04,24.03 17.53,24.51 17.53,26.33 18.1,26.9 18.11,26.9 v18.41,27.2 | U7.23 20.13,31.84 20.64,31.33 20.64,28.97 20.42,28.75 20.42,28.08 v21.16,27.35 | U6.23 29.5,31.84 29.92,31.42 29.92,29.44 29.18,28.7 v29.18,27.51
  Bottom 0.152: v29.18,27.51 21.8,27.51 21.64,27.35 v21.16,27.35 20.83,27.68 19.7,27.68 19.23,27.2 v18.41,27.2
MOSI_AUX
  Top 0.152: U1.14 20.81,18.5 23.15,18.5 25.37,20.73 J5.5
N$1
  Top 0.152: U2.6 19.23,8.61 18.47,9.37 18.47,10.59 17.81,11.24 U1.52
N$2
  Top 0.152: U1.51 17.41,11.21 18.16,10.47 18.16,8.41 19.23,7.34 U2.7
N$3
  Top 0.152: 18.21,11.3 | U2.5 19.64,9.88 18.26,11.25 18.21,11.3 | 18.21,11.3 U1.53
N$4
  Top 0.152: J3.A5 6.87,14.36 7.37,13.86 R4.1
N$5
  Top 0.254: U3.6 4.2,5.38 C3.1
N$7
  Top 0.254: C3.2 5.9,6.62 5.77,6.48 5.77,4.85 | 5.77,4.85 L1.P$1 | U3.5 5.33,4.42 5.77,4.85
N$8
  Top 0.152: J3.B5 7.38,11.36 R5.1
N$9
  Top 0.254: C7.1 12.63,4.38 U4.6
N$10
  Top 0.254: U4.5 14.38,3.43 L2.P$1 14.94,4.27 13.42,5.79 C7.2
N$12
  Top 0.152: R7.2 13.55,10.64 14.64,10.64 15.41,11.41 U1.46
N$13
  Top 0.152: R6.2 15.81,11.38 U1.47
N$14
  Top 0.152: C23.2 Y1.1 18.15,23.05 16.81,23.05 R10.1
N$15
  Top 0.152: R1.1 27.51,2.58 S1.3
N$16  (via drill 0.35)
  Top 0.152: U6.20 27.72,29.56 v27.74,29.54 | v29.54,35.41 29.54,34.74 U6.28
  Bottom 0.152: v27.74,29.54 27.74,32.99 29.54,34.8 v29.54,35.41
N$17  (via drill 0.35)
  Top 0.152: U6.11 24.28,32.86 23.95,32.86 23.6,33.21 23.6,34.75 v24.64,35.79 | U6.1 28.64,35.27 v28.85,35.05
  Bottom 0.152: v24.64,35.79 28.12,35.79 v28.85,35.05
N$18
  Top 0.152: C24.2 24.35,36.82 Y2.3 26.22,36.12 U6.5
N$19
  Top 0.152: U6.4 26.72,37.42 Y2.1 29.09,38.52 C25.2
N$20  (via drill 0.35)
  Top 0.152: v14.53,35.59 14.2,35.26 14.2,33.15 14.5,32.84 U7.11 | v19.41,35.26 18.84,35.26 U7.1
  Bottom 0.152: v19.41,35.26 19.13,35.53 14.58,35.53 v14.53,35.59
N$21  (via drill 0.35)
  Top 0.152: U7.28 20.11,34.7 v20.11,34.94 | v18.31,29.57 18.31,30.41 U7.20
  Bottom 0.152: v20.11,34.94 19.15,33.98 19.15,30.4 v18.31,29.57
N$22
  Top 0.152: C26.2 16.12,36.92 Y3.3 16.82,36.22 U7.5
N$23
  Top 0.152: U7.4 17.32,37.42 Y3.1 C27.2
OBD_H  (via drill 0.35)
  Top 0.152: U6.17 26.22,29.5 26.24,29.48 26.24,29.49 | v26.44,29.29 26.24,29.49 | 26.24,29.49
  Bottom 0.152: J1.6 23.72,48.67 23.72,36.17 23.45,35.89 23.45,32.28 v26.44,29.29
OBD_L  (via drill 0.35)
  Top 0.152: v25.48,29.29 25.72,29.53 U6.16
  Bottom 0.152: v25.48,29.29 23.11,31.65 23.11,40.88 J1.14
QSPI_CS
  Top 0.152: U1.56 19.41,11.39 19.61,11.2 27.04,11.2 27.62,10.62 27.62,6.85 26.85,6.07 U2.1 25.26,6.07 24.19,5 R1.2 R2.1
RX
  Top 0.152: U1.16 19.01,19.24 19.22,19.44 23.05,19.44 26.87,23.27 J5.3
SCK  (via drill 0.35)
  Top 0.152: U1.29 12.59,17.94 12.1,18.43 12.1,19.04 12.65,19.58 12.65,23.44 12.93,23.72 17.17,23.72 17.83,24.38 17.83,26.2 18.22,26.59 v20.62,26.59 20.07,27.15 20.07,28.88 20.27,29.09 20.27,30.9 19.82,31.34 U7.22 | U6.22 29.15,31.19 29.59,30.75 29.59,29.57 28.65,28.62 v28.65,26.98
  Bottom 0.152: v28.65,26.98 21.69,26.98 21.31,26.59 v20.62,26.59
SCK_AUX
  Top 0.152: U1.13 20.89,17.54 21.32,17.97 23.13,17.97 24.61,19.46 28.7,19.46 J5.6
SCL
  Top 0.152: 29.15,6.36 U5.4 28.9,6.36 28.24,7.01 28.24,8.85 R9.1 28.27,10.6 28.27,10.83 27.29,11.81 26.62,11.81 24.89,13.54 U1.3
SCL_AUX
  Top 0.152: U1.9 21.07,15.94 21.56,15.44 27.23,15.44 J5.9
SD1
  Top 0.152: U2.2 26.62,7.34 27.32,8.03 27.32,10.49 26.91,10.9 19.48,10.9 19.01,11.36 U1.55
SD2
  Top 0.152: U2.3 24.56,8.61 22.66,10.52 19.43,10.52 18.61,11.33 U1.54
SDA
  Top 0.152: U1.2 24.86,13.14 26.49,11.51 27.16,11.51 27.93,10.74 27.93,6.61 28.81,5.73 28.9,5.73 U5.3 29.14,5.71 29.41,5.44 29.41,3.96 28.88,3.43 R8.1
SDA_AUX
  Top 0.152: U1.8 20.81,15.54 21.97,14.38 28.7,14.38 J5.10
SWCLK  (via drill 0.35)
  Top 0.152: U1.24 15.81,19.42 15.16,20.07 v13.22,20.07 | v13.22,20.07 | J4.1 7.05,22.06 v8.51,20.6
  Bottom 0.152: v13.22,20.07 10.11,20.07 9.58,20.6 v8.51,20.6
SWDIO  (via drill 0.35)
  Top 0.152: U1.25 15.41,19.37 15.03,19.75 13.88,19.75 13.43,19.3 v13.21,19.3 | v9.3,20.02 9.26,20.06 8.29,20.06 7.58,20.77 6.51,20.77 5.8,20.06 J4.3
  Bottom 0.152: v13.21,19.3 12.82,19.68 9.63,19.68 v9.3,20.02
TX
  Top 0.152: U1.15 19.66,19.02 23.14,19.02 26.11,22 28.7,22 J5.4
USB_D+
  Top 0.152: R6.1 13.02,6.88 10.52,6.88 10.01,7.39 10.01,9.63 8.56,11.07 8.56,12.47 8.34,12.69 7.18,12.69 6.85,12.36 J3.B6 5.53,12.36 5.28,12.6 5.28,13.13 5.51,13.36 J3.A6
USB_D-
  Top 0.152: R7.1 11.85,7.24 10.65,7.24 10.36,7.53 10.36,9.75 8.89,11.23 8.89,12.6 8.5,12.99 7.48,12.99 7.16,13.31 | J3.B7 6.62,13.86 7.16,13.31 | J3.A7 6.7,12.85 7.16,13.31
XIN
  Top 0.152: C22.2 21.92,21.35 Y1.3 20.36,21.23 19.53,20.42 18.48,20.42 17.41,19.32 U1.20
XOUT
  Top 0.152: R10.2 17.01,20.9 U1.21

### Text on the board
bNames: Ryan Petschek 2024 / Rev 1.0 (Aug 24)